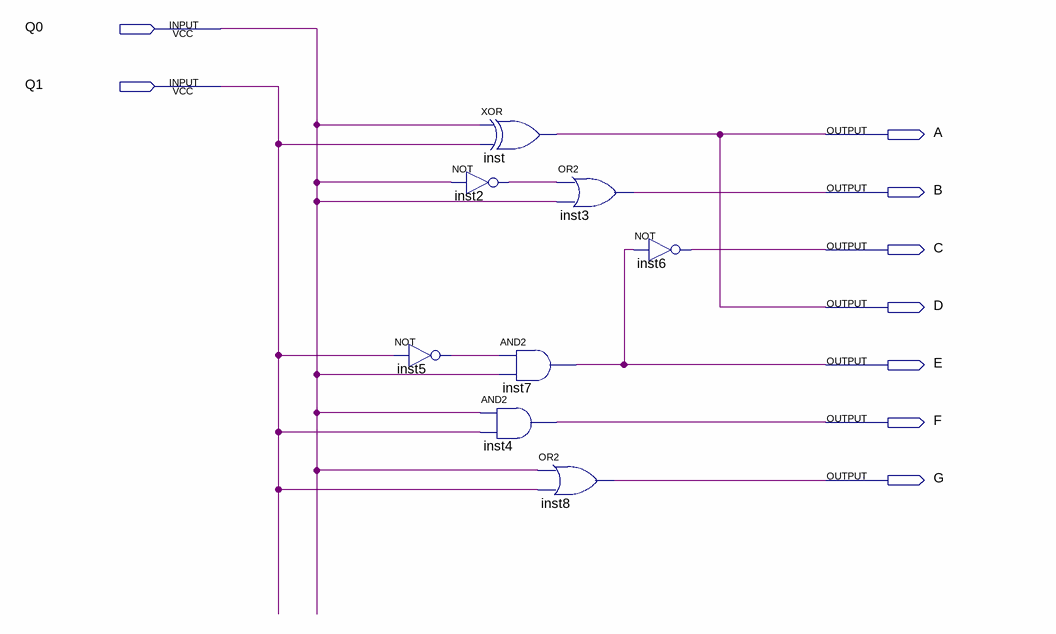
[diagram p0: schematic sheet]
// Quartus schematic phase_counter.bdf as structural Verilog: 8 symbols, 9 pins
module phase_counter (
  input  Q0,
  input  Q1,
  output A,
  output B,
  output C,
  output D,
  output E,
  output F,
  output G
);

  wire inst2_out, inst5_out;

  not inst5 (inst5_out, Q1);
  not inst2 (inst2_out, Q0);
  xor inst (A, Q0, Q1);
  and inst7 (E, inst5_out, Q0);
  and inst4 (F, Q0, Q1);
  or inst8 (G, Q0, Q1);
  or inst3 (B, inst2_out, Q0);
  not inst6 (C, E);

  assign D = A;
endmodule
